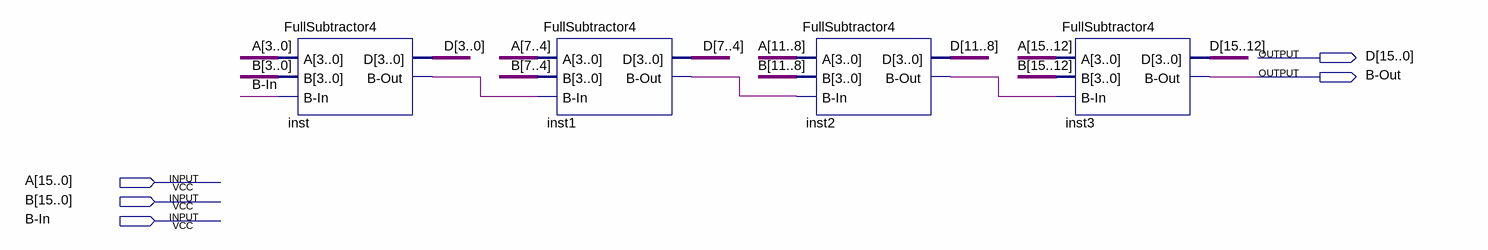
[diagram p0: schematic sheet]
// Quartus schematic FullSubtractor16.bdf as structural Verilog: 4 symbols, 5 pins
module FullSubtractor16 (
  input  [15:0] A,
  input  [15:0] B,
  input  \B-In ,
  output [15:0] D,
  output \B-Out 
);

  wire inst1_b_out, inst2_b_out, inst_b_out;

  FullSubtractor4 inst (.A(A[3:0]), .B(B[3:0]), .\B-In (\B-In ), .D(D[3:0]), .\B-Out (inst_b_out));
  FullSubtractor4 inst1 (.A(A[7:4]), .B(B[7:4]), .\B-In (inst_b_out), .D(D[7:4]), .\B-Out (inst1_b_out));
  FullSubtractor4 inst2 (.A(A[11:8]), .B(B[11:8]), .\B-In (inst1_b_out), .D(D[11:8]), .\B-Out (inst2_b_out));
  FullSubtractor4 inst3 (.A(A[15:12]), .B(B[15:12]), .\B-In (inst2_b_out), .D(D[15:12]), .\B-Out (\B-Out ));
endmodule
